# EAGLE board ZORRO-LAN-IDE-CP (EAGLE 6.6.0)
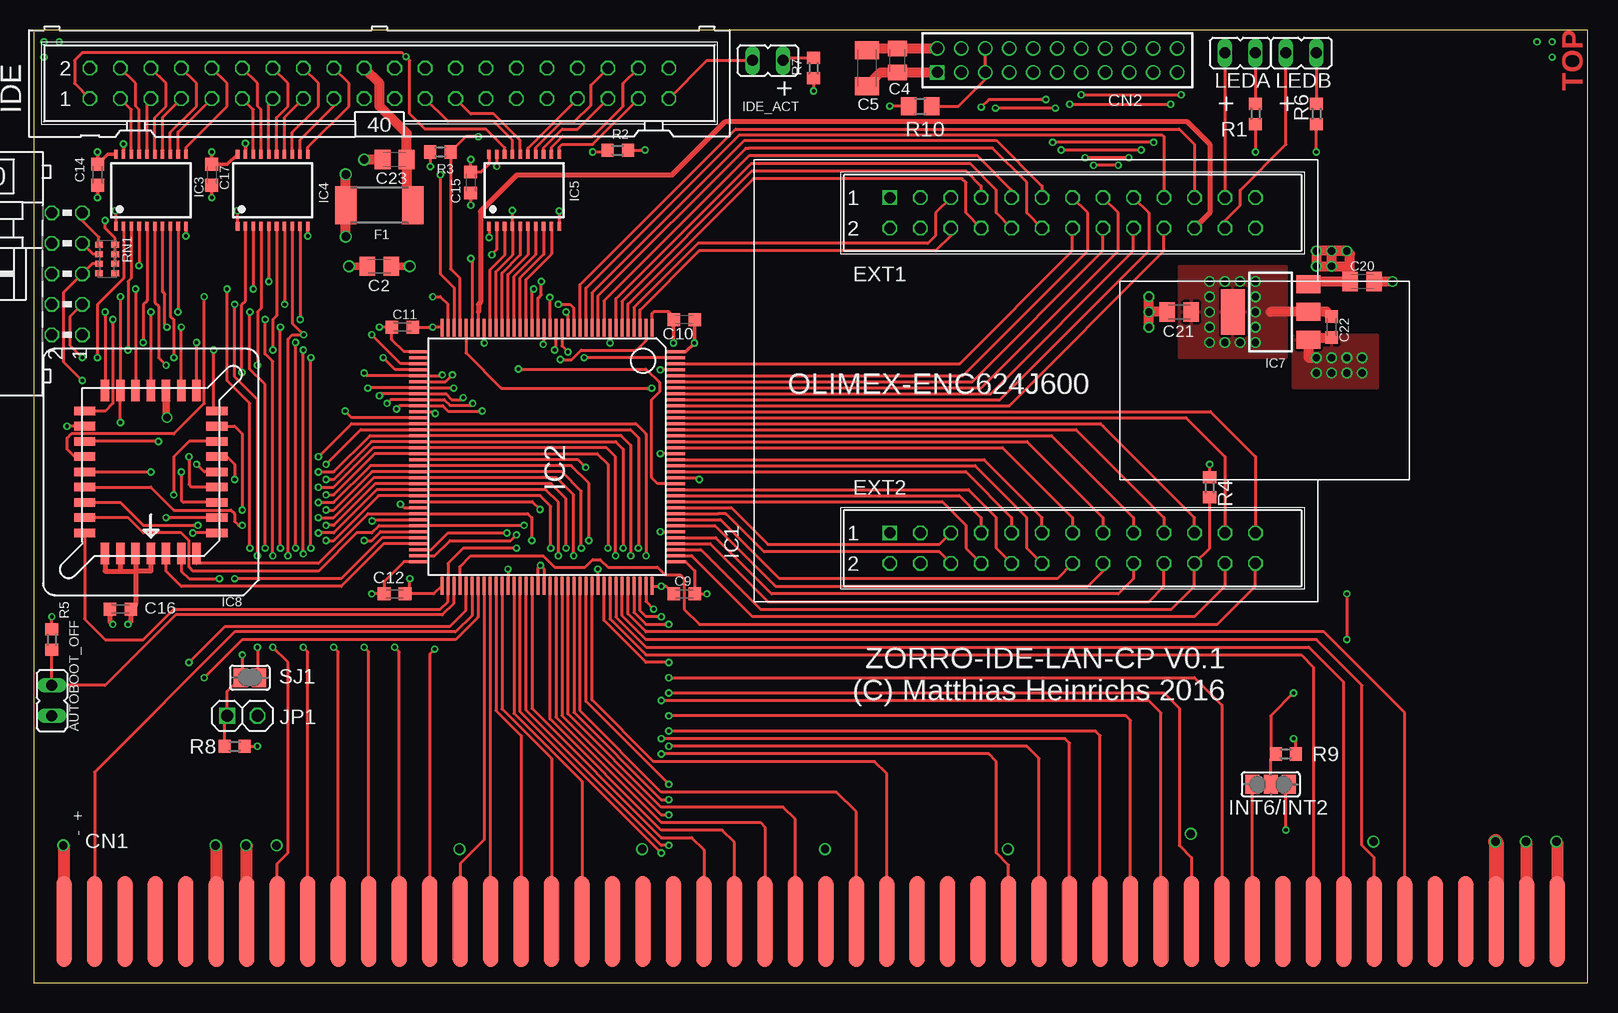
[diagram p3: board, top side]
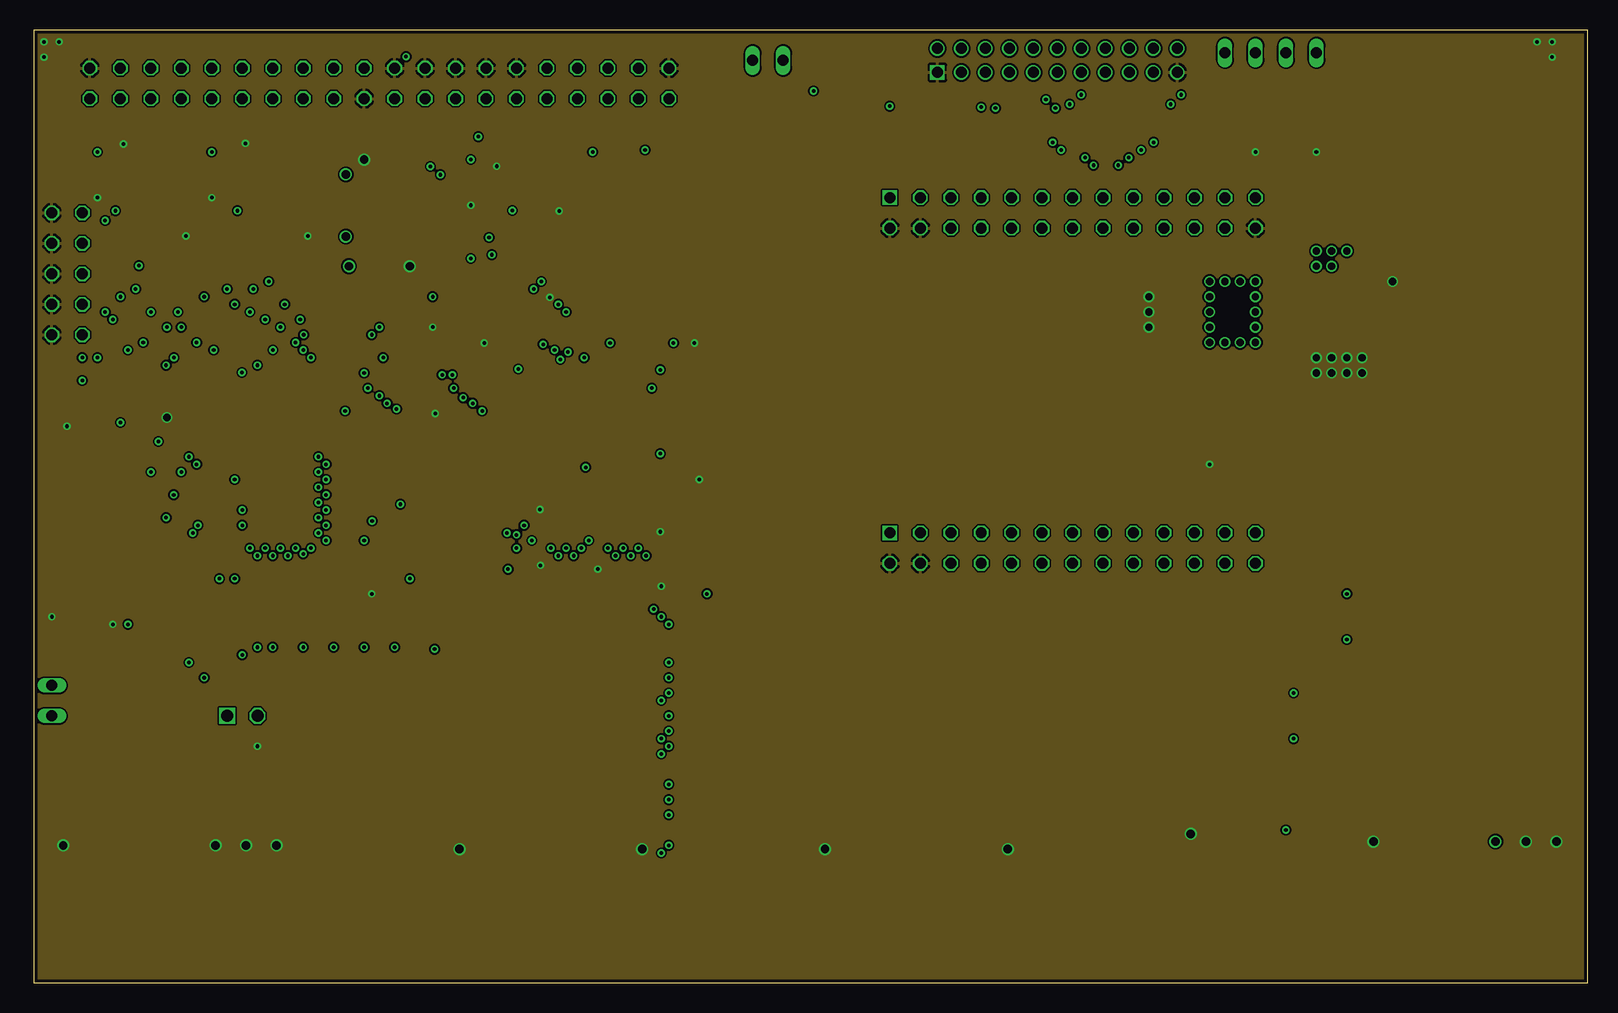
[diagram p4: board, inner layer Route2]
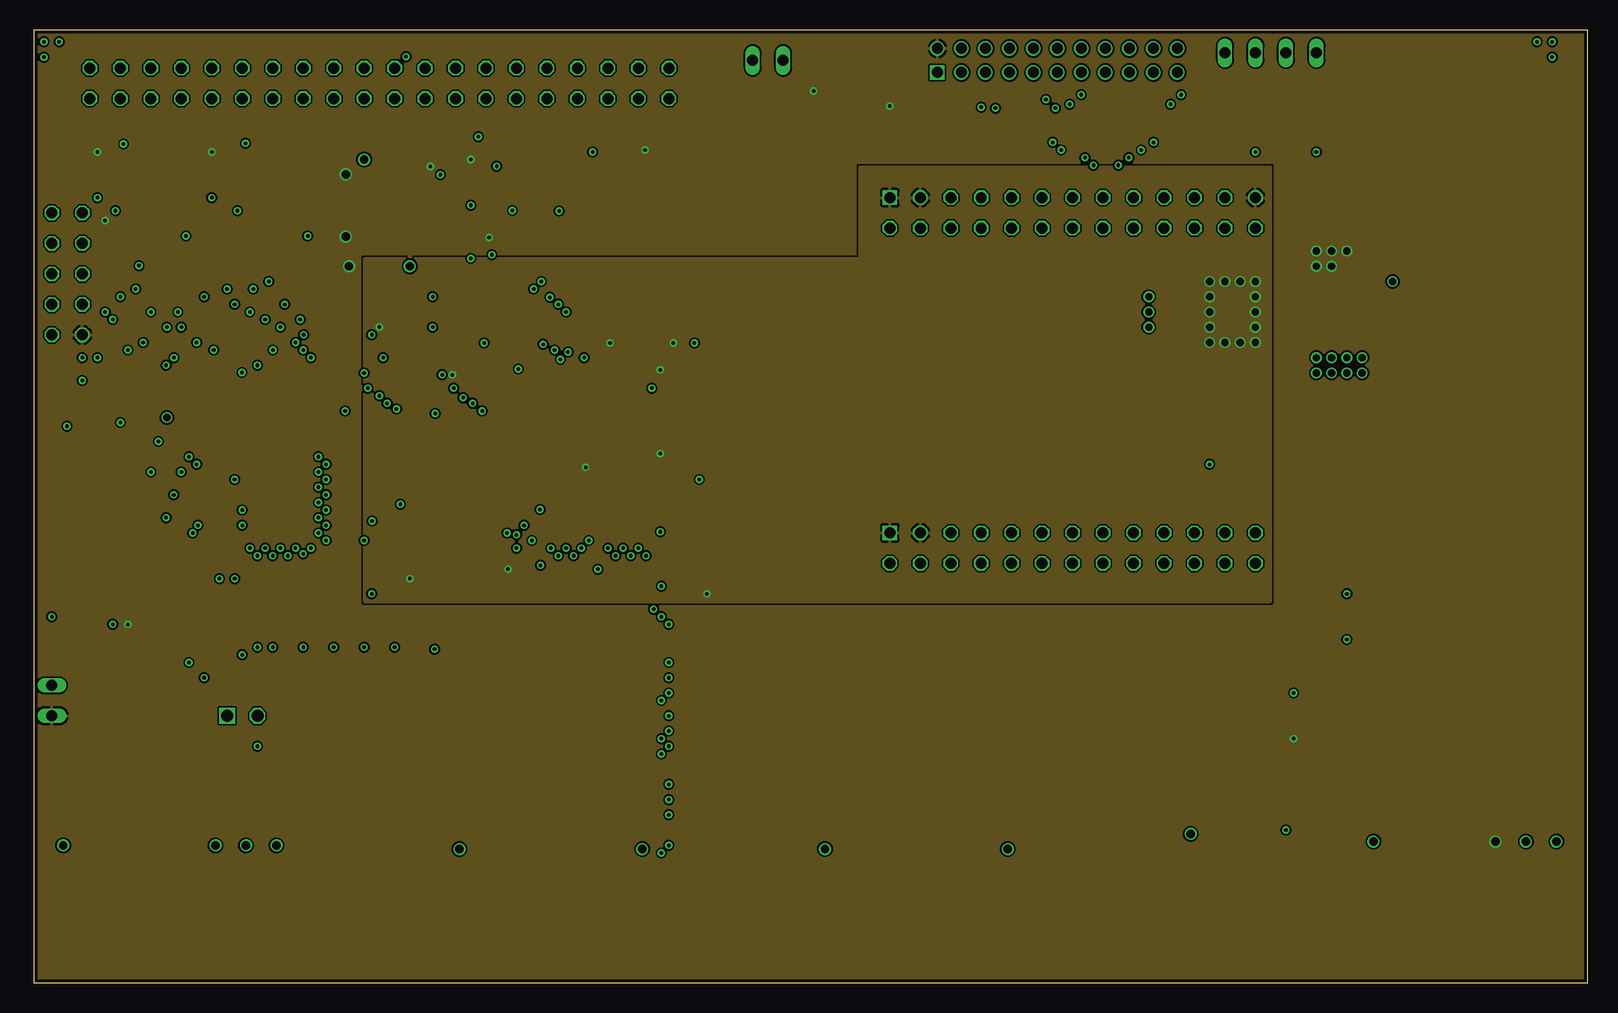
[diagram p5: board, inner layer Route15]
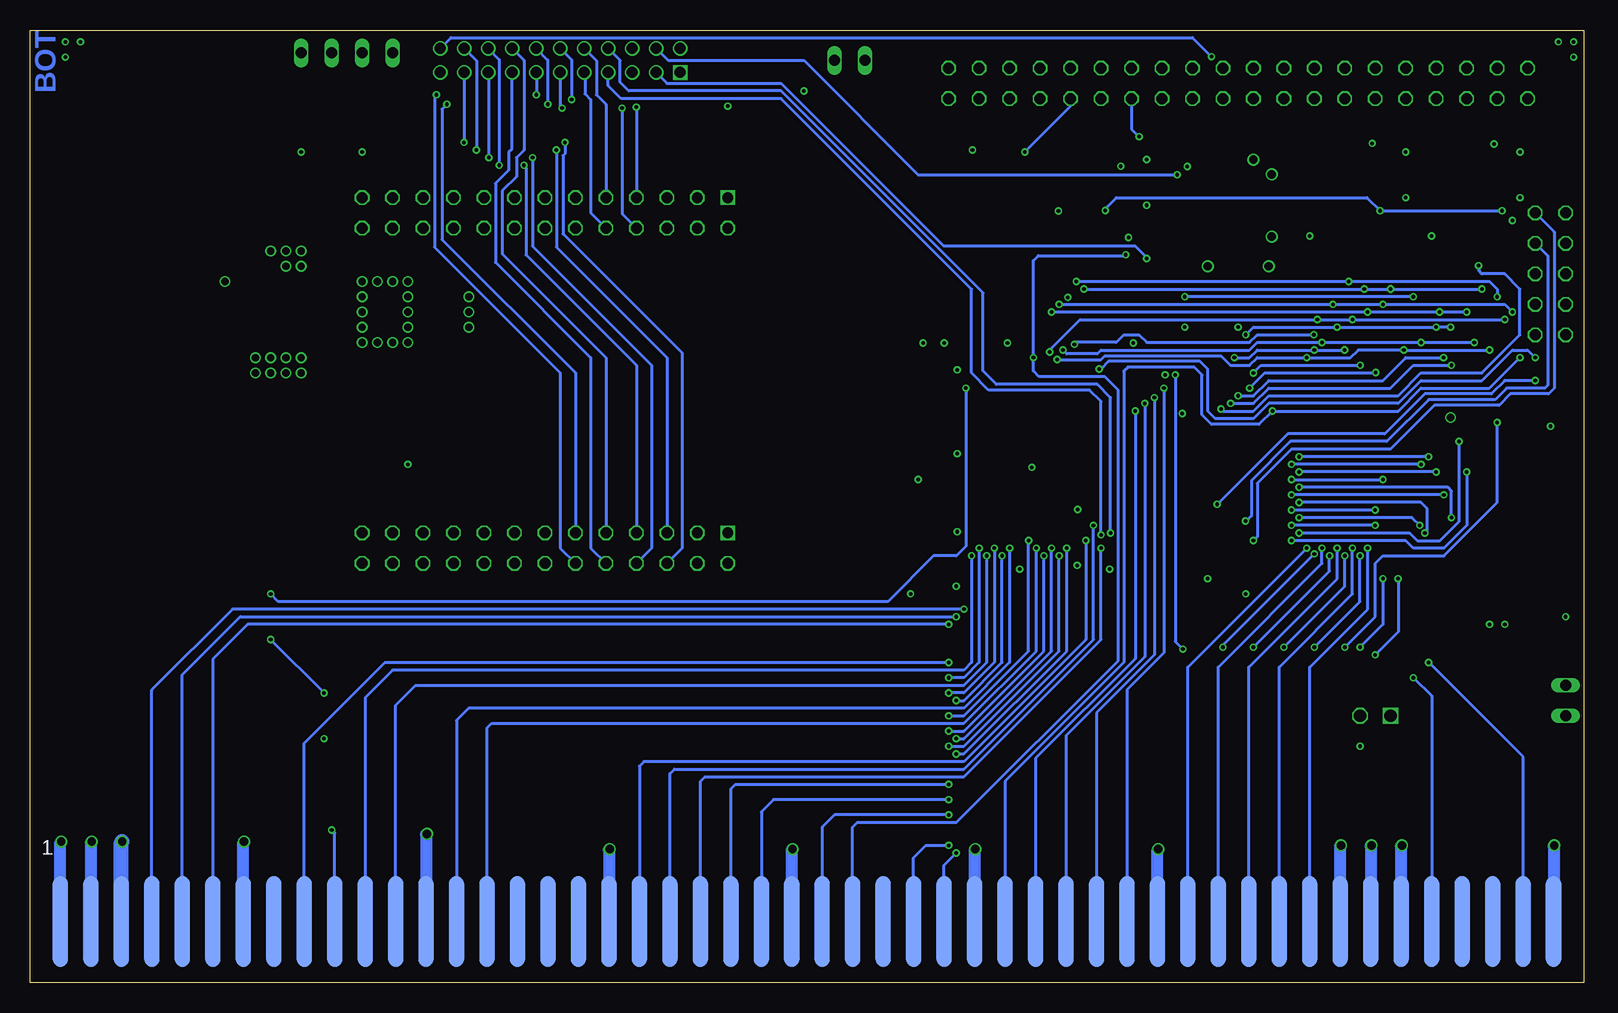
[diagram p6: board, bottom side, seen from below]

Size 129.54 x 79.36 mm. Coordinates in mm from the lower left corner, seen from the top.
Outline: 129.54,0 129.54,79.36 0,79.36 0,0 129.54,0
Copper layers (1+2*15+16): Top 0.035mm / dielectric 0.36mm / Route2 0.035mm / dielectric 0.71mm / Route15 0.035mm / dielectric 0.36mm / Bottom 0.035mm
Design rules "LeitOn - Standard-Eagle-DRU - 4-Lagen Multilayer - deutsch - Rev 2.0 *": minimum track width 0.15mm, minimum drill 0.3mm, track to track 0.15mm, track to pad 0.15mm, pad to pad 0.15mm, via to via 0.15mm, smd to smd 0.15mm, copper to edge 0.3mm, drill to drill 0.3mm, minimum pad ring 0.15mm, minimum via ring 0.15mm, stop-mask expansion 0.075mm, vias tented up to drill 0mil, thermal gap 0.2mm
Net classes: 0 default: width 0.152 mm, drill 0.3 mm; 1 Power: width 0.305 mm, drill 0.3 mm, clearance 0.102 mm

## Footprints (pad centres in the part's own frame; a part is rotated, then mirrored left to right if it is on the bottom)
JP1 = drill 0.914 long: 1 0,-1.27; 2 0,1.27
C0805K = smd 1.3 x 1.6: 1 -1,0; 2 1,0
C1206K = smd 1.5 x 2: 1 -1.5,0; 2 1.5,0
C0603K = smd 1.05 x 1.08: 1 -0.875,0; 2 0.875,0
LKONT_50_R = smd 1.27 x 7.62 bottom: 1 64.77,0; 3 62.23,0; 5 59.69,0; 7 57.15,0; 9 54.61,0; 11 52.07,0; 13 49.53,0; 15 46.99,0; 17 44.45,0; 19 41.91,0; 21 39.37,0; 23 36.83,0; 25 34.29,0; 27 31.75,0; 29 29.21,0; 31 26.67,0; 33 24.13,0; 35 21.59,0; 37 19.05,0; 39 16.51,0; 41 13.97,0; 43 11.43,0; 45 8.89,0; 47 6.35,0; 49 3.81,0; 51 1.27,0; 53 -1.27,0; 55 -3.81,0; 57 -6.35,0; 59 -8.89,0; 61 -11.43,0; 63 -13.97,0; 65 -16.51,0; 67 -19.05,0; 69 -21.59,0; 71 -24.13,0; 73 -26.67,0; 75 -29.21,0; 77 -31.75,0; 79 -34.29,0; 81 -36.83,0; 83 -39.37,0; 85 -41.91,0; 87 -44.45,0; 89 -46.99,0; 91 -49.53,0; 93 -52.07,0; 95 -54.61,0; 97 -57.15,0; 99 -59.69,0 | smd 1.27 x 7.62: 2 64.77,0; 4 62.23,0; 6 59.69,0; 8 57.15,0; 10 54.61,0; 12 52.07,0; 14 49.53,0; 16 46.99,0; 18 44.45,0; 20 41.91,0; 22 39.37,0; 24 36.83,0; 26 34.29,0; 28 31.75,0; 30 29.21,0; 32 26.67,0; 34 24.13,0; 36 21.59,0; 38 19.05,0; 40 16.51,0; 42 13.97,0; 44 11.43,0; 46 8.89,0; 48 6.35,0; 50 3.81,0; 52 1.27,0; 54 -1.27,0; 56 -3.81,0; 58 -6.35,0; 60 -8.89,0; 62 -11.43,0; 64 -13.97,0; 66 -16.51,0; 68 -19.05,0; 70 -21.59,0; 72 -24.13,0; 74 -26.67,0; 76 -29.21,0; 78 -31.75,0; 80 -34.29,0; 82 -36.83,0; 84 -39.37,0; 86 -41.91,0; 88 -44.45,0; 90 -46.99,0; 92 -49.53,0; 94 -52.07,0; 96 -54.61,0; 98 -57.15,0; 100 -59.69,0
CP-2X11-2.00 = drill 0.914 square: 19 -10,-1 | drill 0.914: 20 -10,1; 21 -8,-1; 22 -8,1; 23 -6,-1; 24 -6,1; 25 -4,-1; 26 -4,1; 27 -2,-1; 28 -2,1; 29 0,-1; 30 0,1; 31 2,-1; 32 2,1; 33 4,-1; 34 4,1; 35 6,-1; 36 6,1; 37 8,-1; 38 8,1; 39 10,-1; 40 10,1
R2512 = smd 1.8 x 3.2: 1 -2.8,0; 2 2.8,0
OLIMEX-ENC624J600 = drill 0.914 square: 1 35.56,2.54; 27 35.56,30.48 | drill 0.914 octagon: 2 35.56,5.08; 3 33.02,2.54; 4 33.02,5.08; 5 30.48,2.54; 6 30.48,5.08; 7 27.94,2.54; 8 27.94,5.08; 9 25.4,2.54; 10 25.4,5.08; 11 22.86,2.54; 12 22.86,5.08; 13 20.32,2.54; 14 20.32,5.08; 15 17.78,2.54; 16 17.78,5.08; 17 15.24,2.54; 18 15.24,5.08; 19 12.7,2.54; 20 12.7,5.08; 21 10.16,2.54; 22 10.16,5.08; 23 7.62,2.54; 24 7.62,5.08; 25 5.08,2.54; 26 5.08,5.08; 28 35.56,33.02; 29 33.02,30.48; 30 33.02,33.02; 31 30.48,30.48; 32 30.48,33.02; 33 27.94,30.48; 34 27.94,33.02; 35 25.4,30.48; 36 25.4,33.02; 37 22.86,30.48; 38 22.86,33.02; 39 20.32,30.48; 40 20.32,33.02; 41 17.78,30.48; 42 17.78,33.02; 43 15.24,30.48; 44 15.24,33.02; 45 12.7,30.48; 46 12.7,33.02; 47 10.16,30.48; 48 10.16,33.02; 49 7.62,30.48; 50 7.62,33.02; 51 5.08,30.48; 52 5.08,33.02
TQFP144 = smd 0.27 x 1.5: 1 -8.75,-10.75; 2 -8.25,-10.75; 3 -7.75,-10.75; 4 -7.25,-10.75; 5 -6.75,-10.75; 6 -6.25,-10.75; 7 -5.75,-10.75; 8 -5.25,-10.75; 9 -4.75,-10.75; 10 -4.25,-10.75; 11 -3.75,-10.75; 12 -3.25,-10.75; 13 -2.75,-10.75; 14 -2.25,-10.75; 15 -1.75,-10.75; 16 -1.25,-10.75; 17 -0.75,-10.75; 18 -0.25,-10.75; 19 0.25,-10.75; 20 0.75,-10.75; 21 1.25,-10.75; 22 1.75,-10.75; 23 2.25,-10.75; 24 2.75,-10.75; 25 3.25,-10.75; 26 3.75,-10.75; 27 4.25,-10.75; 28 4.75,-10.75; 29 5.25,-10.75; 30 5.75,-10.75; 31 6.25,-10.75; 32 6.75,-10.75; 33 7.25,-10.75; 34 7.75,-10.75; 35 8.25,-10.75; 36 8.75,-10.75; 73 8.75,10.75; 74 8.25,10.75; 75 7.75,10.75; 76 7.25,10.75; 77 6.75,10.75; 78 6.25,10.75; 79 5.75,10.75; 80 5.25,10.75; 81 4.75,10.75; 82 4.25,10.75; 83 3.75,10.75; 84 3.25,10.75; 85 2.75,10.75; 86 2.25,10.75; 87 1.75,10.75; 88 1.25,10.75; 89 0.75,10.75; 90 0.25,10.75; 91 -0.25,10.75; 92 -0.75,10.75; 93 -1.25,10.75; 94 -1.75,10.75; 95 -2.25,10.75; 96 -2.75,10.75; 97 -3.25,10.75; 98 -3.75,10.75; 99 -4.25,10.75; 100 -4.75,10.75; 101 -5.25,10.75; 102 -5.75,10.75; 103 -6.25,10.75; 104 -6.75,10.75; 105 -7.25,10.75; 106 -7.75,10.75; 107 -8.25,10.75; 108 -8.75,10.75 | smd 1.5 x 0.27: 37 10.75,-8.75; 38 10.75,-8.25; 39 10.75,-7.75; 40 10.75,-7.25; 41 10.75,-6.75; 42 10.75,-6.25; 43 10.75,-5.75; 44 10.75,-5.25; 45 10.75,-4.75; 46 10.75,-4.25; 47 10.75,-3.75; 48 10.75,-3.25; 49 10.75,-2.75; 50 10.75,-2.25; 51 10.75,-1.75; 52 10.75,-1.25; 53 10.75,-0.75; 54 10.75,-0.25; 55 10.75,0.25; 56 10.75,0.75; 57 10.75,1.25; 58 10.75,1.75; 59 10.75,2.25; 60 10.75,2.75; 61 10.75,3.25; 62 10.75,3.75; 63 10.75,4.25; 64 10.75,4.75; 65 10.75,5.25; 66 10.75,5.75; 67 10.75,6.25; 68 10.75,6.75; 69 10.75,7.25; 70 10.75,7.75; 71 10.75,8.25; 72 10.75,8.75; 109 -10.75,8.75; 110 -10.75,8.25; 111 -10.75,7.75; 112 -10.75,7.25; 113 -10.75,6.75; 114 -10.75,6.25; 115 -10.75,5.75; 116 -10.75,5.25; 117 -10.75,4.75; 118 -10.75,4.25; 119 -10.75,3.75; 120 -10.75,3.25; 121 -10.75,2.75; 122 -10.75,2.25; 123 -10.75,1.75; 124 -10.75,1.25; 125 -10.75,0.75; 126 -10.75,0.25; 127 -10.75,-0.25; 128 -10.75,-0.75; 129 -10.75,-1.25; 130 -10.75,-1.75; 131 -10.75,-2.25; 132 -10.75,-2.75; 133 -10.75,-3.25; 134 -10.75,-3.75; 135 -10.75,-4.25; 136 -10.75,-4.75; 137 -10.75,-5.25; 138 -10.75,-5.75; 139 -10.75,-6.25; 140 -10.75,-6.75; 141 -10.75,-7.25; 142 -10.75,-7.75; 143 -10.75,-8.25; 144 -10.75,-8.75
TSSOP20 = smd 0.3 x 0.75: 1 -2.925,-3; 2 -2.275,-3; 3 -1.625,-3; 4 -0.975,-3; 5 -0.325,-3; 6 0.325,-3; 7 0.975,-3; 8 1.625,-3; 9 2.275,-3; 10 2.925,-3; 11 2.925,3; 12 2.275,3; 13 1.625,3; 14 0.975,3; 15 0.325,3; 16 -0.325,3; 17 -0.975,3; 18 -1.625,3; 19 -2.275,3; 20 -2.925,3
SOT223 = smd 1.5 x 2: 1 -2.3,-3.15; 2 0,-3.15; 3 2.3,-3.15 | smd 3.8 x 2: 4 0,3.15
PLCC-32-SMT-TT = smd 0.71 x 1.78: 1 0,6.785; 2 -1.27,6.785; 3 -2.54,6.785; 4 -3.81,6.785; 14 -3.81,-6.785; 15 -2.54,-6.785; 16 -1.27,-6.785; 17 0,-6.785; 18 1.27,-6.785; 19 2.54,-6.785; 20 3.81,-6.785; 30 3.81,6.785; 31 2.54,6.785; 32 1.27,6.785 | smd 1.78 x 0.71: 5 -5.515,5.08; 6 -5.515,3.81; 7 -5.515,2.54; 8 -5.515,1.27; 9 -5.515,0; 10 -5.515,-1.27; 11 -5.515,-2.54; 12 -5.515,-3.81; 13 -5.515,-5.08; 21 5.515,-5.08; 22 5.515,-3.81; 23 5.515,-2.54; 24 5.515,-1.27; 25 5.515,0; 26 5.515,1.27; 27 5.515,2.54; 28 5.515,3.81; 29 5.515,5.08
ML40 = drill 0.914 octagon: 1 -24.13,-1.27; 2 -24.13,1.27; 3 -21.59,-1.27; 4 -21.59,1.27; 5 -19.05,-1.27; 6 -19.05,1.27; 7 -16.51,-1.27; 8 -16.51,1.27; 9 -13.97,-1.27; 10 -13.97,1.27; 11 -11.43,-1.27; 12 -11.43,1.27; 13 -8.89,-1.27; 14 -8.89,1.27; 15 -6.35,-1.27; 16 -6.35,1.27; 17 -3.81,-1.27; 18 -3.81,1.27; 19 -1.27,-1.27; 20 -1.27,1.27; 21 1.27,-1.27; 22 1.27,1.27; 23 3.81,-1.27; 24 3.81,1.27; 25 6.35,-1.27; 26 6.35,1.27; 27 8.89,-1.27; 28 8.89,1.27; 29 11.43,-1.27; 30 11.43,1.27; 31 13.97,-1.27; 32 13.97,1.27; 33 16.51,-1.27; 34 16.51,1.27; 35 19.05,-1.27; 36 19.05,1.27; 37 21.59,-1.27; 38 21.59,1.27; 39 24.13,-1.27; 40 24.13,1.27
SJ_2 = smd 1.168 x 1.6: 1 -1.524,0; 2 0,0; 3 1.524,0
1X02-S = drill 1.016 square: 1 -1.27,0 | drill 1.016 octagon: 2 1.27,0
R0603 = smd 1 x 1.1: 1 -0.85,0; 2 0.85,0
R0805 = smd 1.3 x 1.5: 1 -0.95,0; 2 0.95,0
CAY16 = smd 0.5 x 0.65: 1 -1.2,-0.675; 2 -0.4,-0.675; 3 0.4,-0.675; 4 1.2,-0.675; 5 1.2,0.675; 6 0.4,0.675; 7 -0.4,0.675; 8 -1.2,0.675
SJ = smd 1.168 x 1.6: 1 -0.762,0; 2 0.762,0
ML10L = drill 0.914 octagon: 1 -5.08,-1.27; 2 -5.08,1.27; 3 -2.54,-1.27; 4 -2.54,1.27; 5 0,-1.27; 6 0,1.27; 7 2.54,-1.27; 8 2.54,1.27; 9 5.08,-1.27; 10 5.08,1.27

## Placement (x,y rotation side)
AUTOBOOT_OFF  [JP1]  1.52,23.5 0 top
C2  10u  [C0805K]  28.83,59.69 0 top
C4  100nF  [C0805K]  72.01,76.83 90 top
C5  47uF  [C1206K]  69.47,76.2 270 top
C9  100n  [C0603K]  54.23,32.38 0 top
C10  100n  [C0603K]  54.23,55.24 180 top
C11  100n  [C0603K]  30.73,54.61 0 top
C12  100n  [C0603K]  30.1,32.38 180 top
C14  100n  [C0603K]  5.33,67.31 270 top
C15  100n  [C0603K]  36.45,66.67 270 top
C16  100n  [C0603K]  7.24,31.11 180 top
C17  100n  [C0603K]  14.86,67.31 270 top
C20  10u  [C0805K]  110.74,58.42 0 top
C21  10u  [C0805K]  95.5,55.88 180 top
C22  100n  [C0603K]  108.2,54.61 270 top
C23  10u  [C0805K]  30.1,68.58 180 top
CN1  ZORROII_EDGE_ROUND_CONTACTS  [LKONT_50_R]  62.23,5.08 0 top
CN2  A1200-CLOCKPORT  [CP-2X11-2.00]  85.34,76.83 0 top
F1  500mA  [R2512]  28.83,64.77 180 top
IC1  OLIMEX_ENC  [OLIMEX-ENC624J600]  106.93,67.94 180 top
IC2  XC95288XL-TQ144  [TQFP144]  42.8,43.81 180 top
IC3  74HCT245PW  [TSSOP20]  9.78,66.04 0 top
IC4  74HCT245PW  [TSSOP20]  19.94,66.04 0 top
IC5  74HCT245PW  [TSSOP20]  40.89,66.04 0 top
IC7  LD117AS33TR  [SOT223]  103.12,55.88 90 top
IC8  AM29F010J-SOCKET  [PLCC-32-SMT-TT]  9.78,42.55 180 top
IDE  [ML40]  28.83,74.93 0 top
IDE_ACT  [JP1]  61.21,76.83 90 top
INT6/INT2  [SJ_2]  103.12,16.51 180 top
JP1  [1X02-S]  17.4,22.23 0 top
LEDA  [JP1]  100.58,77.47 90 top
LEDB  [JP1]  105.66,77.47 90 top
R1  330  [R0603]  101.85,72.39 90 top
R2  4.7k  [R0603]  48.69,69.34 180 top
R3  4.7k  [R0603]  33.91,69.22 0 top
R4  100k  [R0603]  98.04,41.27 270 top
R5  4.7k  [R0603]  1.52,28.57 270 top
R6  330  [R0603]  106.93,72.39 90 top
R7  330  [R0603]  65.02,76.2 90 top
R8  4.7k  [R0603]  16.76,19.68 0 top
R9  4.7k  [R0603]  104.39,19.05 180 top
R10  1K  [R0805]  73.91,73.03 0 top
RN1  [CAY16]  6.12,60.3 270 top
SJ1  [SJ]  18.03,25.4 180 top
SV2  [ML10L]  2.79,59.05 90 top

## Tracks (layer width: path | path; a pad name or v marks a point on that pad's centre or on a via)
!AS
  Top 0.254: IC2.80 37.55,11.89 35.56,9.91 CN1.74
!BERR
  Top 0.254: CN1.46 71.12,17.4 70.1,18.41 51.69,18.41 46.55,23.55 IC2.98
!CFIN
  Top 0.254: CN1.12 114.3,22.48 107.57,29.21 51.05,29.21 49.55,30.71 IC2.104
!CFOUT  (via drill 0.3)
  Top 0.254: IC2.105 50.05,30.85 51.05,29.84 v52.96,29.84
  Bottom 0.254: v52.96,29.84 111.38,29.84 114.3,26.92 CN1.11
!DS0  (via drill 0.3)
  Top 0.254: IC2.93 44.05,22.25 52.32,13.97 v52.96,13.97
  Bottom 0.254: v52.96,13.97 62.48,13.97 63.5,12.95 CN1.51
!DS1
  Top 0.254: IC2.78 36.55,30.58 35.18,29.21 16.76,29.21 5.08,17.53 CN1.98
!DTACK
  Top 0.254: IC2.85 40.05,22.43 45.72,16.76 CN1.66
!FCS  (via drill 0.3)
  Top 0.254: v12.95,26.67 15.97,29.69 34.7,29.69 36.05,31.03 IC2.77
  Bottom 0.254: CN1.97 5.08,18.8 v12.95,26.67
!IDE_ACT
  Top 0.254: IDE.39 56.13,76.83 IDE_ACT.2
!IDE_R
  Top 0.254: IC5.16 40.57,70.17 38.35,72.39 36.45,72.39 IDE.25
!IDE_W
  Top 0.254: IC5.17 39.92,70.19 38.35,71.75 34.54,71.75 IDE.23
!LDS
  Top 0.254: IC2.82 38.55,22.66 40.64,20.57 CN1.70
!MTACK
  Top 0.254: CN1.48 68.58,14.22 66.93,15.88 52.32,15.88 45.55,22.65 IC2.96
!MTCR
  Top 0.254: IC2.101 48.05,30.31 51.05,27.3 105.66,27.3 106.68,26.29 CN1.18
!OVR  (via drill 0.3)
  Top 0.254: v52.96,26.67 51.05,26.67 47.55,30.18 IC2.100
  Bottom 0.254: CN1.17 106.68,19.94 99.95,26.67 v52.96,26.67
!OWN  (via drill 0.3)
  Top 0.254: IC2.107 51.05,31.75 v51.69,31.11
  Bottom 0.254: CN1.7 119.38,24.38 112.65,31.11 v51.69,31.11
!RESET  (via drill 0.3)
  Top 0.254: IC2.143 v45.9,52.06 v45.9,52.07 | IC5.2 38.62,61.07 v38.2,60.64
  Bottom 0.254: CN1.53 60.96,12.95 60.58,13.34 52.32,13.34 38.83,26.83 38.83,49.37 39.94,50.48 45.42,50.48 45.9,50.96 v45.9,52.07 45.9,60.17 45.5,60.56 38.28,60.56 v38.2,60.64
!SLAVE  (via drill 0.3)
  Top 0.254: v52.32,30.48 51.05,30.48 50.55,30.98 IC2.106
  Bottom 0.254: CN1.9 116.84,25.65 112.01,30.48 v52.32,30.48
!UDS
  Top 0.254: IC2.81 38.05,5.13 CN1.72
+3V3  (via drill 0.3, 0.6)
  Top 0.254: IC2.141 52.26,51.06 v52.25,51.05 | IC2.8 v48.05,53.3 v48.06,53.29 | IC2.127 v52.25,44.06 v52.25,44.07 | v39.55,34.44 IC2.84 | IC2.1 51.55,55.74 51.69,55.88 52.96,55.88 53.35,55.48 C10.2 | IC2.42 34.33,50.06 v34.91,50.64 | IC2.37 30.87,52.56 29.86,53.58 C11.1 v28.83,54.61 | IC2.109 54.37,35.06 55.1,34.33 C9.2 v56.13,32.38 | v31.37,33.66 31.37,32.78 C12.1 33.37,32.38 IC2.73 | v46.03,42.93 45.39,43.56 IC2.55
  Top 0.305: C10.2 53.35,53.3 v53.34,53.29
  Top 0.813: 108.33,55.61 C22.1 107.78,55.91 107.78,55.88 IC7.2 103.12,55.88
  other vias: 100.58,58.42 99.31,58.42 98.04,58.42 98.04,57.15 98.04,55.88 98.04,54.61 98.04,53.34 99.31,53.34 100.58,53.34 101.85,53.34 101.85,54.61 101.85,55.88 101.85,57.15 101.85,58.42
  pour Top (isolate 0.254): 104.39,59.69 104.39,52.07 95.5,52.07 95.5,59.69
  pour Route15: 27.56,31.75 103.12,31.75 103.12,67.94 68.83,67.94 68.83,60.33 27.56,60.33
+5V  (via drill 0.3, 0.6, 0.7)
  Top 0.254: IC5.20 37.97,68.19 37.32,67.55 C15.1 v36.45,68.58 | IC5.1 v37.97,62.08 | R3.1 v33.06,68.01 v33.07,68 | R7.1 v65.02,74.3 | RN1.8 RN1.7 RN1.6 6.8,62.04 5.97,62.87 v5.97,63.5 | R9.1 105.24,20.11 v105.03,20.32 | R10.1 v71.37,73.03 | R2.1 50.94,69.34 v50.98,69.37
  Top 0.305: IC4.20 16.16,68.19 C17.1 v14.86,69.22 | v5.33,69.22 C14.1 6.19,69.04 IC3.20
  Top 0.406: IC8.32 8.51,34.29 | 8.51,34.29 8.51,31.51 C16.1 8.11,30.09 v7.87,29.84 | IC8.30 5.97,34.29 7.24,34.29 | IC8.31 7.24,34.29 | 7.24,34.29 8.51,34.29 | IC8.1 9.78,34.29 8.51,34.29
  Top 0.61: C2.1 v26.29,59.69
  Top 0.813: 109.52,58.19 C20.1 | C20.1 109.74,60.69 v109.47,60.96 | IC7.3 106.27,58.42 C20.1 | v106.93,59.69 v108.2,59.69 v108.2,60.96 v109.47,60.96 | v109.47,60.96 v106.93,60.96 v106.93,59.69 | v106.93,59.69 109.47,59.69 | F1.2 26.03,67.33 v26.04,67.33 | v26.04,62.15 26.04,64.52 26.29,64.77 | CN2.20 C4.2 69.6,77.83 C5.1
  Top 1.27: v121.86,11.75 121.92,11.68 CN1.5
  Bottom 1.27: CN1.5 121.92,11.68 v121.86,11.75
  pour Route15 (rank 2): -0.38,89.53 129.79,89.53 129.79,-0.64 -0.38,-0.64
A1  (via drill 0.3)
  Top 0.254: v24.38,39.37 25.02,39.37 28.21,42.56 IC2.57 44.05,42.56 45.66,40.96 v45.66,36.2 | IC8.12 16.76,46.35 17.4,45.72 v17.4,39.37
  Bottom 0.254: v17.4,39.37 v24.38,39.37 | CN1.29 91.44,21.21 91.06,21.59 51.69,21.59 45.66,27.62 v45.66,36.2
A2  (via drill 0.3)
  Top 0.254: v24.38,40.64 25.02,40.64 28.44,44.06 IC2.54 46.99,44.06 47.88,43.18 v47.88,36.2 | IC8.11 12.95,45.09 11.68,43.81 v11.68,40.64
  Bottom 0.254: v11.68,40.64 v24.38,40.64 | v47.88,36.2 47.88,26.67 51.69,22.86 92.96,22.86 93.98,21.84 CN1.27
A3  (via drill 0.3)
  Top 0.254: v24.38,41.91 25.02,41.91 28.17,45.06 IC2.52 48.53,45.06 49.15,44.45 v49.15,36.2 | IC8.10 16.13,43.81 16.76,43.18 v16.76,41.91 | v52.96,24.13 94.23,24.13 95.5,22.86 95.5,11.43 96.52,10.41 CN1.26
  Bottom 0.254: v24.38,41.91 v16.76,41.91 | v49.15,36.2 49.15,26.67 51.69,24.13 v52.96,24.13
A4  (via drill 0.3)
  Top 0.254: v24.38,43.18 27.27,46.06 IC2.50 49.76,46.06 50.42,45.4 v50.42,36.2 | IC8.9 14.22,42.55 v13.59,43.18 | v52.96,25.4 96.77,25.4 99.06,23.11 CN1.24
  Bottom 0.254: v13.59,43.18 v24.38,43.18 | v50.42,36.2 50.42,26.67 51.69,25.4 v52.96,25.4
A5  (via drill 0.3)
  Top 0.254: v23.75,43.81 26.5,46.56 IC2.49 50.21,46.56 51.05,45.72 v51.05,35.56 | IC8.8 13.2,41.27 12.95,41.52 v12.95,43.81
  Bottom 0.254: v12.95,43.81 v23.75,43.81 | v51.05,35.56 51.05,26.67 51.69,26.04 99.31,26.04 101.6,23.75 CN1.21
A6  (via drill 0.3)
  Top 0.254: v23.75,42.55 25.02,42.55 28.04,45.56 IC2.51 48.99,45.56 49.78,44.77 v49.78,35.56 | IC8.7 12.48,40.01 12.32,40.16 v12.32,42.55
  Bottom 0.254: v12.32,42.55 v23.75,42.55 | CN1.23 99.06,23.11 97.41,24.77 51.69,24.77 49.78,26.67 v49.78,35.56
A7  (via drill 0.3)
  Top 0.254: v23.75,41.27 25.02,41.27 28.31,44.56 IC2.53 47.76,44.56 48.51,43.81 v48.51,35.56 | IC8.6 v11.05,38.73 | CN1.28 93.98,22.48 92.96,23.5 v52.32,23.5
  Bottom 0.254: v11.05,38.73 11.05,40.96 11.37,41.27 v23.75,41.27 | v52.32,23.5 51.69,23.5 48.51,26.67 v48.51,35.56
A8  (via drill 0.3)
  Top 0.254: v23.75,40.01 25.02,40.01 28.08,43.06 IC2.56 44.82,43.06 46.29,41.59 v46.29,36.83 | IC8.5 v13.27,37.47 | CN1.30 91.44,21.84 91.06,22.23 v52.96,22.23
  Bottom 0.254: v23.75,40.01 13.59,40.01 13.11,39.53 13.11,37.62 v13.27,37.47 | v52.96,22.23 51.69,22.23 46.29,27.62 v46.29,36.83
A9  (via drill 0.3)
  Top 0.254: v23.75,38.73 25.02,38.73 28.35,42.06 IC2.58 43.6,42.06 45.02,40.64 v45.02,35.56 | IC8.27 7.24,40.01 9.14,38.1 v13.7,38.1 | CN1.32 88.9,20.57 88.52,20.95 v52.96,20.95
  Bottom 0.254: v23.75,38.73 14.33,38.73 v13.7,38.1 | v52.96,20.95 51.69,20.95 45.02,27.62 v45.02,35.56
A10  (via drill 0.3)
  Top 0.254: v24.38,38.1 25.02,38.1 28.48,41.56 IC2.59 43.14,41.56 44.39,40.32 v44.39,36.2 | IC8.26 9.78,41.27 11.68,39.37 16.45,39.37 16.76,39.05 16.76,38.42 17.08,38.1 v17.4,38.1 | CN1.34 86.36,19.94 85.98,20.32 v52.32,20.32
  Bottom 0.254: v17.4,38.1 v24.38,38.1 | v52.32,20.32 51.69,20.32 44.39,27.62 v44.39,36.2
A11  (via drill 0.3)
  Top 0.254: CN1.36 83.82,18.67 82.8,19.68 v52.96,19.68 | v43.75,35.56 43.75,40.01 42.69,41.06 IC2.60 28.62,41.06 25.02,37.47 v23.75,37.47 | v10.41,45.09 IC8.23
  Bottom 0.254: v52.96,19.68 51.69,19.68 43.75,27.62 v43.75,35.56 | v23.75,37.47 14.54,37.47 13.91,36.83 12,36.83 10.41,38.42 v10.41,45.09
A12  (via drill 0.3)
  Top 0.254: IC8.25 v9.78,42.55 | CN1.38 81.28,9.78 80.26,10.79 80.26,18.41 79.63,19.05 v52.32,19.05 | v43.12,36.2 43.12,39.69 42.24,40.56 IC2.61 28.75,40.56 25.02,36.83 v24.38,36.83
  Bottom 0.254: v52.32,19.05 51.69,19.05 43.12,27.62 v43.12,36.2 | v9.78,42.55 9.78,38.1 11.68,36.2 14.22,36.2 14.86,36.83 v24.38,36.83
A13  (via drill 0.3)
  Top 0.254: v41.53,36.83 41.53,38.73 41.2,39.06 IC2.64 27.89,39.06 23.75,34.92 13.59,34.92 IC8.4
  Bottom 0.254: v41.53,36.83 41.53,28.57 51.69,18.41 78.36,18.41 78.74,18.03 CN1.39
A14  (via drill 0.3)
  Top 0.254: IC8.28 7.87,38.73 9.14,37.47 12.32,37.47 12.95,36.83 12.95,34.62 13.28,34.29 23.75,34.29 26.92,37.47 28.19,37.47 28.79,38.06 IC2.66 40.93,38.06 v40.89,38.1
  Bottom 0.254: CN1.41 76.2,17.4 75.82,17.78 51.69,17.78 40.89,28.57 v40.89,38.1
A15  (via drill 0.3)
  Top 0.254: IC8.29 4.26,30.28 5.97,28.57 9.14,28.57 11.68,31.11 33.91,31.11 34.54,31.75 IC2.74 34.55,34.93 35.81,36.2 v40.26,36.2
  Bottom 0.254: CN1.43 73.66,16.76 73.28,17.14 51.69,17.14 40.26,28.57 v40.26,36.2
A16  (via drill 0.3)
  Top 0.254: v52.96,16.51 46.05,23.42 IC2.97
  Bottom 0.254: CN1.45 71.12,16.13 70.74,16.51 v52.96,16.51
A17  (via drill 0.3)
  Top 0.254: IC2.95 45.05,22.52 52.32,15.24 v52.96,15.24
  Bottom 0.254: v52.96,15.24 67.56,15.24 68.58,14.22 CN1.47
A18
  Top 0.254: CN1.52 63.5,13.59 62.48,14.61 52.32,14.61 44.55,22.38 IC2.94
A19
  Top 0.254: IC2.92 43.55,22.11 52.32,13.34 60.58,13.34 60.96,12.95 CN1.54
A20
  Top 0.254: CN1.56 58.42,11.68 57.4,12.7 52.32,12.7 43.05,21.98 IC2.91
A21
  Top 0.254: IC2.88 41.55,22.84 52.32,12.06 54.86,12.06 55.88,11.05 CN1.58
A22  (via drill 0.3)
  Top 0.254: v52.96,11.43 52.32,11.43 41.05,22.7 IC2.87
  Bottom 0.254: CN1.57 55.88,10.41 54.86,11.43 v52.96,11.43
A23  (via drill 0.3)
  Top 0.254: v52.32,10.79 40.55,22.57 IC2.86
  Bottom 0.254: CN1.59 53.34,9.78 v52.32,10.79
AUTO_BOOT_OFF
  Top 0.254: R5.2 AUTOBOOT_OFF.2 5.97,24.77 11.84,30.64 34.07,30.64 35.05,31.62 IC2.75
C1
  Top 0.254: CN1.14 111.76,10.41 110.74,11.43 110.74,24.77 106.93,28.57 51.05,28.57 49.05,30.58 IC2.103
C3
  Top 0.254: IC2.102 48.55,30.45 51.05,27.94 106.3,27.94 109.22,25.02 CN1.16
C_IDE_A0
  Top 0.254: IC5.7 41.87,60.66 40.05,58.84 IC2.24
C_IDE_A1
  Top 0.254: IC5.5 40.57,60.63 39.05,59.12 IC2.26
C_IDE_A2
  Top 0.254: IC5.6 41.22,60.65 39.55,58.98 IC2.25
C_IDE_CS0
  Top 0.254: IC5.9 43.17,60.7 41.05,58.58 IC2.22
C_IDE_CS1
  Top 0.254: IC2.23 40.55,58.71 42.52,60.68 IC5.8
C_IDE_R  (via drill 0.3)
  Top 0.254: v6.83,64.31 6.83,63.02 IC3.1 | IC2.27 38.55,59.25 39.92,60.62 IC5.4 39.92,64.32 v39.9,64.34 | IC4.1 17.01,64.29 v16.99,64.31
  Bottom 0.254: v6.83,64.31 v16.99,64.31 18.09,65.41 38.99,65.41 39.9,64.49 v39.9,64.34
C_IDE_W
  Top 0.254: IC5.3 39.27,60.6 38.05,59.38 IC2.28
CLK_EXT
  Top 0.254: 37.08,55.88 37.05,55.84 IC2.30
  Top 0.406: 37.08,55.88 37.08,56.52 37.26,56.69 37.26,64.26 40.31,67.31 53.24,67.31 57.68,71.75 96.14,71.75 98.04,69.85 98.04,64.14 IC1.22
CP_CS  (via drill 0.3)
  Top 0.254: v33.91,67.31 33.91,59.05 35.05,57.91 IC2.34
  Bottom 0.254: CN2.22 76.34,76.83 65.02,76.83 55.5,67.31 v33.91,67.31
CP_IRQ  (via drill 0.3)
  Top 0.254: v36.45,60.33 36.55,60.23 IC2.31
  Bottom 0.254: CN2.21 76.44,74.93 66.93,74.93 53.36,61.36 37.4,61.36 36.45,60.4 v36.45,60.33
CP_RD  (via drill 0.3)
  Top 0.254: IC2.71 33.44,35.56 34.7,36.83 39.78,36.83 v40.26,37.31
  Bottom 0.254: v40.26,37.31 40.26,48.42 41.21,49.37 49.63,49.37 51.05,50.8 51.05,57.78 66.93,73.66 80.26,73.66 81.34,74.74 CN2.25
CP_WE  (via drill 0.3)
  Top 0.254: IC2.70 33.14,36.06 34.54,37.47 v39.47,37.47
  Bottom 0.254: v39.47,37.47 39.47,48.74 40.58,49.85 48.99,49.85 50.1,50.96 50.1,57.47 66.93,74.3 79.63,74.3 80.34,75.01 80.34,76.83 CN2.26
D0  (via drill 0.3)
  Top 0.254: IC3.3 8.15,58.7 7.87,58.42 v7.87,52.7 | IC8.13 15.02,47.9 v15.02,52.7 | v23.11,36.2 v23.11,52.07 | IC2.2 51.05,53.49 50.26,52.7 45.66,52.7 44.86,51.91 v43.91,51.91
  Bottom 0.254: v43.91,51.91 40.26,51.91 39.94,52.23 30.26,52.23 29.46,51.44 27.88,51.44 27.24,52.07 v23.11,52.07 19.46,52.07 18.83,52.7 v15.02,52.7 v7.87,52.7 | CN1.75 33.02,26.29 v23.11,36.2
D1  (via drill 0.3)
  Top 0.254: IC8.14 v13.59,53.34 | IC3.5 9.45,56.83 9.14,56.52 v9.14,53.34 | v21.84,36.2 v21.84,53.34 | v43.43,52.7 43.55,52.82 IC2.17
  Bottom 0.254: v9.14,53.34 v13.59,53.34 v21.84,53.34 27.24,53.34 27.88,52.7 40.26,52.7 40.58,52.39 43.12,52.39 v43.43,52.7 | CN1.77 30.48,26.29 21.84,34.92 v21.84,36.2
D2  (via drill 0.3)
  Top 0.254: IC8.15 v12.32,54.61 | IC2.39 30.6,51.56 v28.19,53.98 | v11.13,54.61 10.95,54.79 10.95,57.35 10.75,57.55 IC3.7 | v20.57,36.2 v20.57,54.61
  Bottom 0.254: v11.13,54.61 v12.32,54.61 v20.57,54.61 27.56,54.61 v28.19,53.98 | CN1.79 27.94,26.29 20.57,33.66 v20.57,36.2
D3  (via drill 0.3)
  Top 0.254: v9.78,55.88 IC8.17 | IC3.9 12.05,55.89 v12.04,55.88 | v19.3,36.2 19.3,49.85 18.03,51.12 v18.03,55.88 | IC2.15 44.55,55.72 v44.39,55.88
  Bottom 0.254: v44.39,55.88 v18.03,55.88 v12.04,55.88 v9.78,55.88 | CN1.81 25.4,26.29 19.3,32.38 v19.3,36.2
D4  (via drill 0.3)
  Top 0.254: v8.51,57.78 IC8.18 | IC4.3 v18.31,57.79 v18.31,57.78 | v18.03,36.2 18.03,48.26 16.13,50.16 v16.13,57.78 | IC2.21 41.55,57.65 v41.69,57.78
  Bottom 0.254: v41.69,57.78 v18.31,57.78 v16.13,57.78 v8.51,57.78 | CN1.83 22.86,26.29 18.03,31.11 v18.03,36.2
D5  (via drill 0.3)
  Top 0.254: v7.24,57.15 IC8.19 v7.24,46.67 | IC4.5 v19.61,58.42 | CN1.86 20.32,9.91 21.21,10.79 21.21,26.67 v19.94,27.94 | IC2.20 42.05,57.03 42.32,57.31 v42.32,58.42
  Bottom 0.254: v42.32,58.42 v19.61,58.42 7.87,58.42 7.24,57.78 v7.24,57.15 | v7.24,46.67 7.24,40.01 11.68,35.56 16.76,35.56 17.4,34.92 17.4,30.48 v19.94,27.94
D6  (via drill 0.3)
  Top 0.254: v5.97,55.88 IC8.20 | IC4.7 20.91,56.53 v20.93,56.52 | CN1.84 22.86,27.56 v22.48,27.94 | v18.67,35.56 18.67,48.58 16.76,50.48 v16.76,56.52 | IC2.14 45.05,56.17 44.7,56.52 v43.75,56.52
  Bottom 0.254: v43.75,56.52 v20.93,56.52 v16.76,56.52 6.6,56.52 v5.97,55.88 | v22.48,27.94 18.67,31.75 v18.67,35.56
D7  (via drill 0.3)
  Top 0.254: v6.6,55.24 6.6,48.26 5.97,47.62 IC8.21 | IC4.9 22.21,55.26 v22.23,55.24 | CN1.82 25.4,27.56 v25.02,27.94 | v19.94,35.56 19.94,51.75 19.3,52.39 v19.3,55.24 | IC2.16 44.05,53.04 v44.55,52.55
  Bottom 0.254: v6.6,55.24 v19.3,55.24 v22.23,55.24 42.01,55.24 44.55,52.7 v44.55,52.55 | v25.02,27.94 19.94,33.02 v19.94,35.56
D8  (via drill 0.3)
  Top 0.254: IC4.8 21.56,54.93 v22.52,53.98 21.56,53.98 21.21,53.62 v21.21,35.56 | CN1.80 27.94,27.56 v27.56,27.94 | v42.48,53.18 42.55,53.25 IC2.19
  Bottom 0.254: v22.52,53.98 27.24,53.98 27.88,53.34 36.45,53.34 37.08,53.98 38.35,53.98 38.99,53.34 42.32,53.34 v42.48,53.18 | v27.56,27.94 21.21,34.29 v21.21,35.56
D9  (via drill 0.3)
  Top 0.254: IC2.40 30.15,51.06 v29.15,52.07 | CN1.78 30.48,27.56 v30.1,27.94 | v22.48,35.72 v22.48,52.7 | IC4.6 20.26,55.57 19.94,55.24 19.94,52.72 v19.95,52.7
  Bottom 0.254: v19.95,52.7 v22.48,52.7 27.24,52.7 27.88,52.07 v29.15,52.07 | v30.1,27.94 30.1,28.1 v22.48,35.72
D10  (via drill 0.3)
  Top 0.254: v27.56,50.8 27.79,50.56 IC2.41 33.99,50.56 v34.07,50.64 | v33.43,27.78 33.02,27.37 CN1.76 | IC4.4 18.96,56.17 18.67,55.88 v18.67,51.45 v18.66,51.44
  Bottom 0.254: v18.66,51.44 26.92,51.44 v27.56,50.8 | v34.07,50.64 34.07,28.42 v33.43,27.78
D11  (via drill 0.3)
  Top 0.254: v27.88,49.53 27.91,49.56 IC2.43 34.99,49.56 v35.02,49.53 | v17.36,50.83 17.36,56.48 17.66,56.78 IC4.2
  Bottom 0.254: v17.36,50.83 17.39,50.8 26.61,50.8 v27.88,49.53 | v35.02,49.53 35.02,27.46 38.1,24.38 CN1.71
D12  (via drill 0.3)
  Top 0.254: v28.83,48.9 29,49.06 IC2.44 34.37,49.06 34.86,48.58 35.66,48.58 v35.81,48.74 | IC3.8 11.4,55.5 11.71,55.19 v11.71,52.07
  Bottom 0.254: v11.71,52.07 14.86,52.07 16.76,50.16 26.29,50.16 27.56,48.9 v28.83,48.9 | v35.81,48.74 35.81,27.3 40.64,22.48 CN1.69
D13  (via drill 0.3)
  Top 0.254: v29.46,48.26 29.77,48.56 IC2.45 34.24,48.56 34.7,48.1 36.45,48.1 v36.61,48.26 | IC3.6 10.1,56.65 10.41,56.34 10.41,52.07 v11.05,51.44
  Bottom 0.254: v29.46,48.26 27.56,48.26 26.29,49.53 16.13,49.53 14.22,51.44 v11.05,51.44 | v36.61,48.26 36.61,27.15 43.18,20.57 CN1.67
D14  (via drill 0.3)
  Top 0.254: v30.26,47.78 30.54,48.06 IC2.46 34.1,48.06 34.54,47.62 v37.4,47.62 | IC3.4 8.8,59.76 v8.79,59.74
  Bottom 0.254: v30.26,47.78 30.1,47.62 27.56,47.62 26.29,48.9 15.49,48.9 13.59,50.8 8.51,50.8 5.33,53.98 5.33,57.78 6.6,59.05 8.51,59.05 8.79,59.33 v8.79,59.74 | v37.4,47.62 37.4,26.99 45.72,18.67 CN1.65
D15  (via drill 0.3)
  Top 0.254: v5.33,52.07 5.33,56.52 7.5,58.69 IC3.2 | IC2.48 26.53,47.06 v25.97,47.62
  Bottom 0.254: v5.33,52.07 7.87,49.53 13.59,49.53 15.49,47.62 v25.97,47.62 27.08,46.51 31.05,46.51 31.85,47.31 31.85,50.64 32.48,51.28 38.04,51.28 38.35,50.96 38.35,26.67 48.26,16.76 CN1.63
DQ0  (via drill 0.3)
  Top 0.254: IC2.118 58.16,39.56 61.21,36.51 75.5,36.51 IC1.31 | v92.33,69.37 v85.66,69.37
  Bottom 0.254: CN2.38 92.33,76.82 v92.33,69.37 | v85.66,69.37 85.66,61.28 76.45,52.07 IC1.31
DQ1  (via drill 0.3)
  Top 0.254: IC2.117 57.07,39.06 57.09,39.05 57.72,39.05 60.9,35.88 75.5,35.88 IC1.32 | v93.36,70.01 v84.95,70.01
  Bottom 0.254: CN2.37 93.36,75.82 v93.36,70.01 | v84.95,70.01 84.95,69.06 85.11,68.9 85.11,62.39 75.18,52.47 75.18,36.2 IC1.32
DQ2  (via drill 0.3)
  Top 0.254: IC2.120 77.16,40.56 78.99,38.73 IC1.33 | v90.42,68.1 v88.36,68.1
  Bottom 0.254: CN2.36 90.42,76.92 v90.42,68.1 | v88.36,68.1 88.2,67.94 88.2,60.64 78.99,51.44 IC1.33
DQ3  (via drill 0.3)
  Top 0.254: IC2.119 75.76,40.06 77.72,38.1 77.72,36.2 IC1.34 | v91.3,68.74 v87.65,68.74
  Bottom 0.254: CN2.35 91.3,75.79 v91.3,68.74 | v87.65,68.74 87.65,61.36 77.72,51.44 77.72,36.2 IC1.34
DQ4
  Top 0.254: IC2.124 77.7,42.56 81.53,38.73 IC1.35
  Bottom 0.254: CN2.34 88.36,76.85 88.36,69.37 89,68.74 89,67.15 90.19,65.96 90.19,60.72 81.53,52.07 IC1.35
DQ5
  Top 0.254: IC1.36 80.26,36.2 80.26,38.73 77.93,41.06 IC2.121
  Bottom 0.254: CN2.33 89.39,75.79 89.39,69.45 89.63,69.22 89.63,67.71 90.74,66.6 90.74,60.01 82.8,52.07 82.8,36.2 IC1.36
DQ6  (via drill 0.3)
  Top 0.254: IC1.37 84.07,38.73 79.24,43.56 IC2.126 | v86.38,73.18 v94.79,73.18
  Bottom 0.254: CN2.32 86.38,76.87 v86.38,73.18 | v94.79,73.18 95.19,72.79 95.19,61.91 84.07,50.8 IC1.37
DQ7  (via drill 0.3)
  Top 0.254: IC1.38 82.8,36.2 82.8,38.73 78.47,43.06 IC2.125 | v87.33,73.98 v95.66,73.98
  Bottom 0.254: CN2.31 v87.33,73.98 | v95.66,73.98 95.82,73.82 95.82,61.28 85.34,50.8 85.34,36.2 IC1.38
DQ8
  Top 0.254: IC2.128 80.78,44.56 86.61,38.73 IC1.39
DQ9
  Top 0.254: IC2.116 57.26,38.56 62.17,33.66 85.34,33.66 IC1.40
DQ10
  Top 0.254: IC2.129 82.82,45.06 89.15,38.73 IC1.41
DQ11
  Top 0.254: IC2.115 56.8,38.06 61.85,33.02 87.88,33.02 89.15,34.29 IC1.42
DQ12
  Top 0.254: IC2.130 84.86,45.56 91.69,38.73 IC1.43
DQ13
  Top 0.254: IC2.113 56.85,37.06 61.53,32.38 90.42,32.38 91.69,33.66 IC1.44
DQ14
  Top 0.254: IC2.131 53.56,46.08 86.89,46.08 94.23,38.73 IC1.45
DQ15
  Top 0.254: IC2.112 56.4,36.56 61.21,31.75 92.96,31.75 94.23,33.02 IC1.46
GND  (via drill 0.3, 0.6, 0.7)
  Top 0.254: v52.25,37.57 v52.25,37.56 IC2.114 | IC2.99 v47.05,34.43 v47.04,34.44 | IC2.90 42.55,34.46 v42.25,34.76 42.05,34.56 IC2.89 | IC2.18 43.05,57.12 v43.03,57.1 | v37.57,53.29 37.55,53.31 IC2.29 | IC2.62 41.57,40.06 v42.22,39.42 | IC5.19 38.62,68.03 v38.61,68.02 | v43.82,64.29 IC5.10 | C15.2 v36.45,64.77 | R5.1 v1.52,30.48 | IC2.36 34,54.61 v33.27,54.61 C11.2 | C9.1 52.72,33.02 v52.32,33.02 51.59,33.02 IC2.108 | IC2.123 55.34,42.06 v55.5,41.91 | IC2.72 30.87,35.06 29.22,33.41 C12.2 v28.19,32.38 | IC8.22 v2.79,46.35 | IC2.47 33.33,47.56 v33.48,47.41 | R8.2 v18.67,19.68 | R4.1 v98.04,43.18 | R1.1 v101.85,69.22 | v106.93,69.22 R6.1
  Top 0.305: C17.2 v14.86,65.41 | IC3.10 v12.7,62.21 v12.7,62.2 | IC4.10 v22.86,62.21 v22.86,62.2 | IC4.19 17.66,69.92 v17.65,69.93 | IC3.19 7.5,69.86 v7.49,69.88 | C14.2 v5.33,65.41 | IC2.144 54.37,52.56 v55.09,53.29 C10.1
  Top 0.406: C16.2 6.36,30.09 v6.6,29.84
  Top 0.61: C2.2 v31.37,59.69 | v11.13,47.09 11.05,47.17 IC8.16
  Top 0.813: 108.09,53.62 C22.2 106.27,53.73 IC7.1 106.27,52.07 v106.93,52.07 | C20.2 v113.28,58.42 | C21.2 v92.96,55.88 | v92.96,54.61 v92.96,57.15 | C23.2 v27.56,68.58 | C5.2 70.6,75.83 C4.1 CN2.19
  Top 1.016: CN1.99 2.54,11.37 v2.48,11.43 | v15.18,11.43 15.24,11.37 CN1.89 | CN1.87 17.78,11.37 v17.72,11.43 | v126.94,11.75 127,11.68 CN1.1 | CN1.3 124.46,11.68 v124.4,11.75
  Bottom 1.016: v2.48,11.43 2.54,11.37 CN1.99 | CN1.89 15.24,11.37 v15.18,11.43 | v17.72,11.43 17.78,11.37 CN1.87 | CN1.85 20.32,11.37 v20.26,11.43 | CN1.73 35.56,11.05 v35.5,11.11 | v50.74,11.11 50.8,11.05 CN1.61 | CN1.49 66.04,11.05 v65.98,11.11 | v81.22,11.11 81.28,11.05 CN1.37 | CN1.1 127,11.68 v126.94,11.75 | v124.4,11.75 124.46,11.68 CN1.3 | CN1.13 111.76,11.68 v111.7,11.75 | v96.46,12.38 96.52,12.32 CN1.25
  other vias: 110.74,52.07 109.47,52.07 108.2,52.07 110.74,50.8 109.47,50.8 108.2,50.8 106.93,50.8 0.86,78.38 2.13,78.38 0.86,77.11 126.59,78.38 125.32,78.38 126.59,77.11
  pour Route2: -0.38,0 129.79,0 129.79,90.17 -0.38,90.17
  pour Top: 112.01,53.98 112.01,49.53 105.03,49.53 105.03,53.98
IDE_A0
  Top 0.254: IC5.13 42.52,69.57 44.07,71.12 45.34,71.12 IDE.35
IDE_A1
  Top 0.254: IC5.15 41.22,69.54 IDE.33
IDE_A2
  Top 0.254: IC5.14 41.87,69.56 44.07,71.75 45.11,71.75 46.46,73.1 46.46,74.78 IDE.36
IDE_CS0
  Top 0.254: IC5.11 43.82,69.6 44.07,69.85 46.61,69.85 IDE.37
IDE_CS1
  Top 0.254: IC5.12 43.17,69.58 44.07,70.48 46.61,70.48 49.15,73.03 49.15,74.93 IDE.38
IDE_IRQ  (via drill 0.3)
  Top 0.254: v46.61,69.22 47.72,69.22 R2.2
  Bottom 0.254: IDE.31 42.8,73.03 v46.61,69.22
IDE_RST  (via drill 0.3)
  Top 0.254: IC5.18 39.27,69.57 37.72,71.12 32.64,71.12 31.37,72.39 31.37,76.83 v31.05,77.15 30.73,77.47 4.06,77.47 3.43,76.83 3.43,74.93 IDE.1
  Bottom 0.254: CN2.40 94.44,78.74 32.64,78.74 v31.05,77.15
IDE_WAIT  (via drill 0.3)
  Top 0.254: v37.08,70.48 36.03,70.48 R3.2 34.76,59.48 35.55,58.69 IC2.33
  Bottom 0.254: IDE.27 37.72,71.12 v37.08,70.48
IDED0
  Top 0.254: IC4.12 22.21,70.22 25.02,73.03 IDE.17
IDED1
  Top 0.254: IC4.14 20.91,72.09 IDE.15
IDED2
  Top 0.254: IC4.16 19.61,73.33 IDE.13
IDED3
  Top 0.254: IC4.18 18.31,72.75 IDE.11
IDED4
  Top 0.254: IC3.12 12.05,70.86 IDE.9
IDED5
  Top 0.254: IC3.14 10.75,72.09 IDE.7
IDED6
  Top 0.254: IC3.16 9.45,73.33 IDE.5
IDED7
  Top 0.254: IC3.18 8.15,72.75 IDE.3
IDED8
  Top 0.254: IC3.17 8.8,72.73 8.51,73.03 8.51,74.93 IDE.4
IDED9
  Top 0.254: IC3.15 10.1,72.08 11.05,73.03 11.05,74.93 IDE.6
IDED10
  Top 0.254: IC3.13 11.4,70.84 13.59,73.03 13.59,74.93 IDE.8
IDED11
  Top 0.254: IC3.11 12.7,69.6 16.13,73.03 16.13,74.93 IDE.10
IDED12
  Top 0.254: IC4.17 18.96,72.73 18.67,73.03 18.67,74.93 IDE.12
IDED13
  Top 0.254: IC4.15 20.26,72.08 21.21,73.03 21.21,74.93 IDE.14
IDED14
  Top 0.254: IC4.13 21.56,70.84 23.75,73.03 23.75,74.93 IDE.16
IDED15
  Top 0.254: IC4.11 22.86,69.6 26.29,73.03 26.29,74.93 IDE.18
INT2  (via drill 0.3)
  Top 0.254: v104.39,12.7 104.39,16.26 INT6/INT2.1
  Bottom 0.254: CN1.19 104.14,12.45 v104.39,12.7
INT6
  Top 0.254: CN1.22 INT6/INT2.3
INT_OUT  (via drill 0.3)
  Top 0.254: IC2.32 36.05,52.47 38.99,49.53 v51.53,49.53 | v109.47,32.38 v109.47,28.57 | v105.03,24.13 103.12,22.23 103.12,19.47 R9.2 103.12,18.63 INT6/INT2.2
  Bottom 0.254: v51.53,49.53 51.53,36.35 52.32,35.56 54.23,35.56 58.04,31.75 108.84,31.75 v109.47,32.38 | v109.47,28.57 v105.03,24.13
KEY_PIN_POWER
  Top 0.813: F1.1 31.1,65.3 C23.1 31.1,70.75 28.83,73.03 28.83,74.93 IDE.20
LAN_A0
  Top 0.254: IC2.4 50.04,54.58 50.04,56.26 55.37,61.59 74.55,61.59 75.18,62.23 75.18,64.14 IC1.5
LAN_A1
  Top 0.254: IC2.3 50.55,56.03 55.47,60.96 75.18,60.96 76.45,62.23 IC1.6
LAN_A2  (via drill 0.3)
  Top 0.254: IC2.6 49.05,56.77 59.91,67.63 77.72,67.63 78.99,66.36 IC1.7 | v84.39,73.58 79.63,73.58 v78.99,72.95
  Bottom 0.254: CN2.30 84.39,76.88 v84.39,73.58 | v78.99,72.95 IC1.7
LAN_A3  (via drill 0.3)
  Top 0.254: IC2.5 49.55,56.53 60.01,66.99 77.41,66.99 77.72,66.67 77.72,64.14 IC1.8 | v85.19,72.87 v80.19,72.87
  Bottom 0.254: CN2.29 85.34,73.03 v85.19,72.87 | v80.19,72.87 80.19,64.06 IC1.8
LAN_A4
  Top 0.254: IC2.9 47.55,56.79 59.65,68.9 78.68,68.9 81.53,66.04 IC1.9 | IC2.9
  Bottom 0.254: CN2.28 82.33,76.82 82.33,73.98 81.53,73.18 IC1.9
LAN_A5
  Top 0.254: IC2.7 48.55,56.98 59.83,68.26 78.04,68.26 80.26,66.04 80.26,64.14 IC1.10
  Bottom 0.254: CN2.27 83.28,75.77 83.28,74.06 82.8,73.58 82.8,64.14 IC1.10
LAN_A6
  Top 0.254: IC2.11 46.55,57.47 59.25,70.17 80.26,70.17 84.07,66.36 IC1.11
LAN_A7
  Top 0.254: IC2.10 47.05,57.21 59.37,69.53 59.63,69.53 59.94,69.53 79.95,69.53 82.8,66.67 82.8,64.14 IC1.12
LAN_A8
  Top 0.254: IC2.140 77.49,50.56 87.88,60.96 87.88,64.14 IC1.13
LAN_A9
  Top 0.254: IC2.142 77.22,51.56 86.61,60.96 IC1.14
LAN_A10
  Top 0.254: IC2.138 79.03,49.56 90.42,60.96 90.42,64.14 IC1.15
LAN_A11
  Top 0.254: IC2.139 78.26,50.06 89.15,60.96 IC1.16
LAN_A12
  Top 0.254: IC1.17 92.96,64.14 92.96,60.96 80.57,48.56 IC2.136
LAN_A13
  Top 0.254: IC2.137 79.8,49.06 91.69,60.96 IC1.18
LAN_CFG1
  Top 0.254: IC1.19 94.23,70.48 94.08,70.64 58.83,70.64 46.05,57.86 IC2.12
LAN_CFG3
  Top 0.254: IC1.21 96.77,69.85 95.5,71.12 58.52,71.12 45.55,58.15 IC2.13
LAN_CFG4
  Top 0.254: IC1.50 99.31,33.02 96.77,30.48 59.94,30.48 54.86,35.56 IC2.110
LAN_CGF2
  Top 0.254: IC2.135 81.34,48.06 94.23,60.96 IC1.20
LAN_CS
  Top 0.254: IC2.133 96.06,47.06 99.31,43.81 IC1.49
LAN_EN
  Top 0.254: IC2.76 35.55,34.66 36.45,35.56 42.48,35.56 43.43,34.61 45.97,34.61 46.61,35.24 47.24,35.24 47.88,34.61 52.01,34.61 52.64,33.97 53.91,33.97 54.23,33.66 54.23,31.11 55.5,29.84 98.68,29.84 101.85,33.02 IC1.52
LAN_INT
  Top 0.254: IC2.111 55.63,36.06 60.58,31.11 94.87,31.11 96.77,33.02 IC1.48 98.04,36.2 R4.2
LAN_RD
  Top 0.254: IC1.51 101.85,43.81 98.1,47.56 IC2.134
LAN_WRH
  Top 0.254: IC1.47 96.77,38.73 89.47,46.04 89.15,46.35 88.94,46.56 IC2.132
LEDA
  Top 0.254: LEDA.2 IC1.23
LEDB
  Top 0.254: IC1.24 99.31,63.5 100.58,64.77 100.58,66.04 104.39,69.85 LEDB.2
N$1
  Top 0.254: LEDA.1 R1.2
N$2
  Top 0.254: LEDB.1 R6.2
N$3
  Top 0.254: R10.2 77.09,73.03 79.34,75.28 CN2.23 CN2.24
N$40  (via drill 0.3)
  Top 0.254: IC2.68 29.06,37.06 25.65,33.66 v16.76,33.66 | v18.67,27.94 18.67,25.53 SJ1.1
  Bottom 0.254: v16.76,33.66 16.76,29.84 v18.67,27.94
N$42
  Top 0.254: IDE_ACT.1 62.7,77.05 R7.2
R/W
  Top 0.254: IC2.83 39.05,22.8 43.18,18.67 CN1.68
ROM_B0  (via drill 0.3)
  Top 0.254: IC8.3 12.32,34.29 12.95,33.66 v15.49,33.66 | R8.1 15.91,22.01 JP1.1 16.13,24.26 SJ1.2 17.4,25.53 v17.4,27.3
  Bottom 0.254: v15.49,33.66 15.49,29.21 v17.4,27.3
ROM_B1
  Top 0.254: IC2.69 29.2,36.56 25.65,33.02 12.32,33.02 11.05,34.29 IC8.2
ROM_OE  (via drill 0.3)
  Top 0.254: IC8.24 3.43,43.81 2.79,44.45 2.79,45.36 3.15,45.72 11.68,45.72 14.22,48.26 v14.22,57.15 | IC2.35 34.55,56.51 33.91,57.15 v33.27,57.15
  Bottom 0.254: v14.22,57.15 v33.27,57.15
TCK  (via drill 0.3)
  Top 0.254: v27.56,36.83 28.19,36.83 28.93,37.56 IC2.67 | RN1.1 5.45,62.12 4.06,63.5 SV2.9
  Bottom 0.254: SV2.9 2.49,62.56 2.49,49.52 2.95,49.05 6.13,49.05 7.08,48.1 12.48,48.1 16.13,44.45 24.38,44.45 27.24,41.59 27.24,37.15 v27.56,36.83
TDI  (via drill 0.3)
  Top 0.254: v30.58,39.85 30.87,39.56 IC2.63 | v4.06,50.16 2.49,51.74 2.49,57.48 SV2.5 4.91,59.9 RN1.3
  Bottom 0.254: v30.58,39.85 v30.57,39.85 24.7,45.72 16.61,45.72 13.27,49.05 7.72,49.05 6.6,50.16 v4.06,50.16
TDO  (via drill 0.3)
  Top 0.254: SV2.3 3.02,55.47 3.02,53.11 v4.06,52.07 | IC2.122 52.03,41.56 51.53,42.07 51.53,48.58 52.17,49.21 52.17,50.01 51.05,51.12 v40.42,51.12
  Bottom 0.254: v40.42,51.12 40.26,51.12 39.62,51.75 32,51.75 31.37,51.12 31.37,47.62 30.73,46.99 27.56,46.99 26.29,48.26 15.49,48.26 13.59,50.16 8.51,50.16 5.97,52.7 4.7,52.7 v4.06,52.07
TMS  (via drill 0.3)
  Top 0.254: v28.22,38.46 28.33,38.56 IC2.65 | RN1.2 4.96,60.7 SV2.7
  Bottom 0.254: SV2.7 3.02,60.55 3.02,49.76 3.25,49.53 6.45,49.53 7.4,48.58 12.95,48.58 16.45,45.09 24.46,45.09 27.72,41.83 27.72,38.89 28.16,38.46 v28.22,38.46
Z3  (via drill 0.3)
  Top 0.254: IC2.79 37.05,30.45 35.18,28.57 17.4,28.57 v14.22,25.4
  Bottom 0.254: v14.22,25.4 12.7,23.88 CN1.91

## Text on the board
Top: TOP
Bottom: BOT
tNames: + | + | + | ZORRO-IDE-LAN-CP V0.1 / (C) Matthias Heinrichs 2016 | - +